# Altium project ASSICopy.PrjPcb
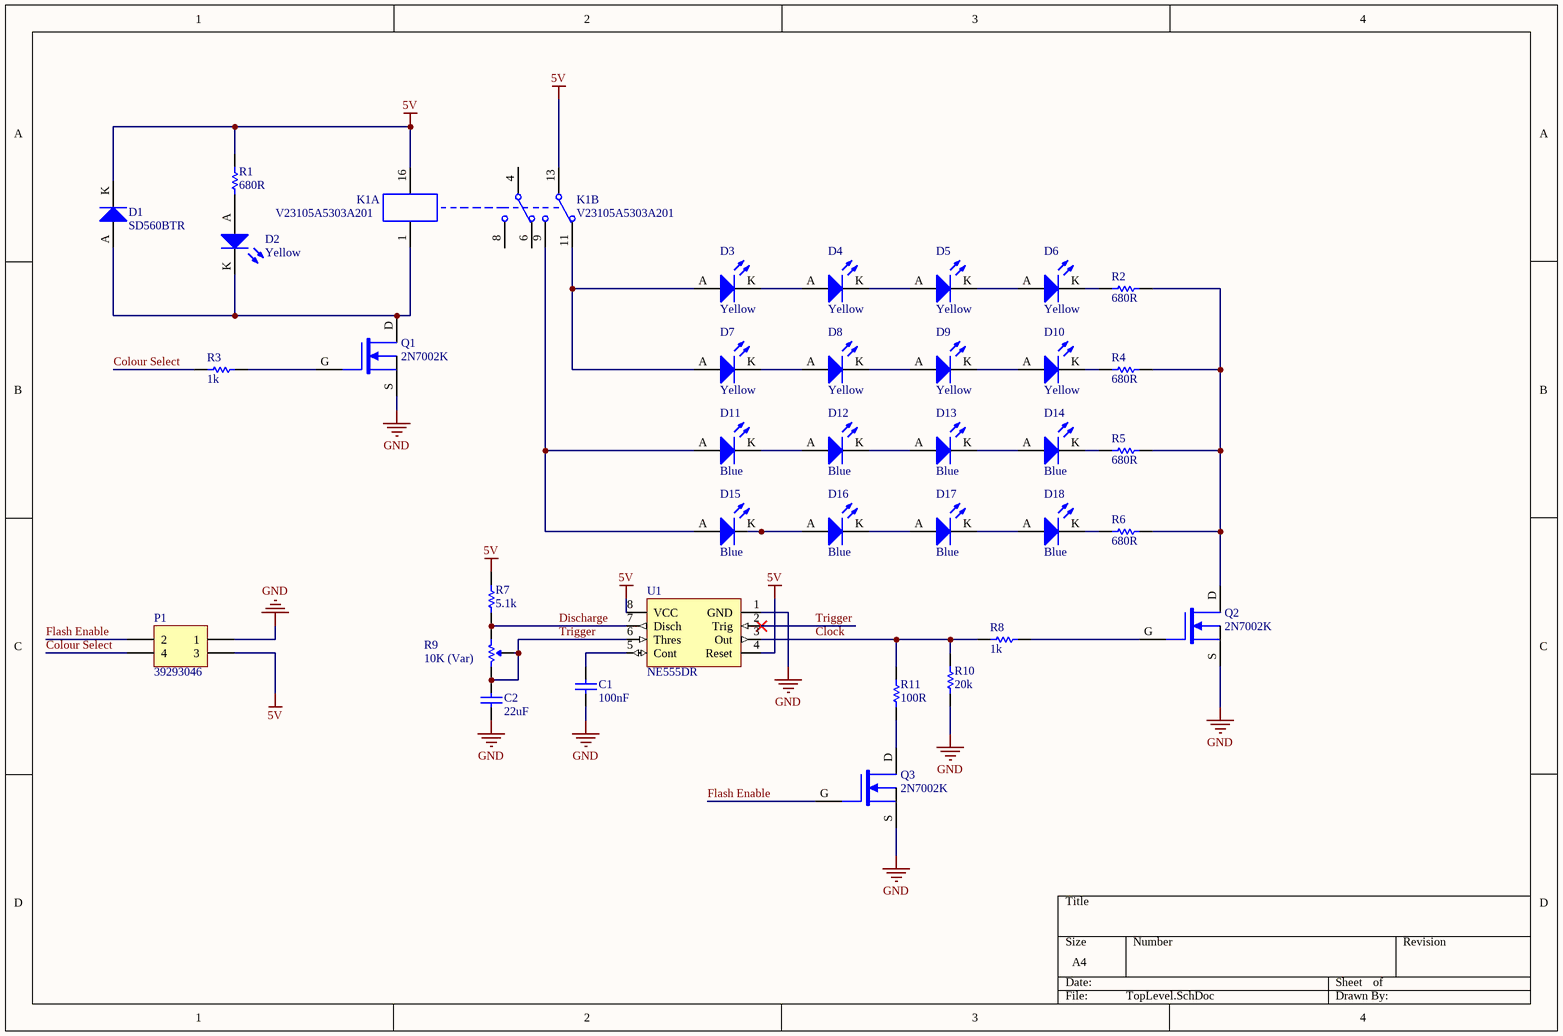
[diagram p0: TopLevel.SchDoc]
1 sheet, 37 parts. Net scope: global (net labels, ports and power ports of the same name join across sheets).
Board file: ASSI_R5.PcbDoc

## Sheet TopLevel.SchDoc
size A4; SheetNumber: 1; SheetTotal: 1

### Parts
C1  100nF  [0805]
C2  22uF  [1206]
D1  SD560BTR  [SMB Diode]
D2  Yellow  [0805 LED]
D3  Yellow  [0805 LED]
D4  Yellow  [0805 LED]
D5  Yellow  [0805 LED]
D6  Yellow  [0805 LED]
D7  Yellow  [0805 LED]
D8  Yellow  [0805 LED]
D9  Yellow  [0805 LED]
D10  Yellow  [0805 LED]
D11  Blue  [0805 LED]
D12  Blue  [0805 LED]
D13  Blue  [0805 LED]
D14  Blue  [0805 LED]
D15  Blue  [0805 LED]
D16  Blue  [0805 LED]
D17  Blue  [0805 LED]
D18  Blue  [0805 LED]
K1  V23105A5303A201  [TI 2-DIL]  (parts A,B of 2)
P1  39293046  [39293046]
Q1  2N7002K  [ON SOT-23 MOSFET]
Q2  2N7002K  [ON SOT-23 MOSFET]
Q3  2N7002K  [ON SOT-23 MOSFET]
R1  680R  [0805]
R2  680R  [0805]
R3  1k  [0805]
R4  680R  [0805]
R5  680R  [0805]
R6  680R  [0805]
R7  5.1k  [0805]
R8  1k  [0805]
R9  10K (Var)  [B 3296]
R10  20k  [0805]
R11  100R  [0805]
U1  NE555DR  [TI 8-SOIC]

### Nets
5V: D1.K K1.13 K1.16 P1.3 R1.2 R7.2 U1.4(Reset) U1.8(VCC)
GND: C1.1 C2.1 P1.1 Q1.S Q2.S Q3.S R10.1 U1.1(GND)
Clock: R8.1 R10.2 R11.2 U1.3(Out)
Colour Select: P1.4 R3.1
Discharge: R7.1 R9.3(CW) U1.7(Disch)
Flash Enable: P1.2 Q3.G
Trigger: C2.2 R9.1(CCW) R9.2(Wiper) U1.2(Trig) U1.6(Thres)
NetC1_2: C1.2 U1.5(Cont)
NetD1_A: D1.A D2.K K1.1 Q1.D
NetD2_A: D2.A R1.1
NetD3_A: D3.A D7.A K1.11
NetD3_K: D3.K D4.A
NetD4_K: D4.K D5.A
NetD5_K: D5.K D6.A
NetD6_K: D6.K R2.1
NetD7_K: D7.K D8.A
NetD8_K: D8.K D9.A
NetD9_K: D9.K D10.A
NetD10_K: D10.K R4.1
NetD11_A: D11.A D15.A K1.9
NetD11_K: D11.K D12.A
NetD12_K: D12.K D13.A
NetD13_K: D13.K D14.A
NetD14_K: D14.K R5.1
NetD15_K: D15.K D16.A
NetD16_K: D16.K D17.A
NetD17_K: D17.K D18.A
NetD18_K: D18.K R6.1
NetQ1_G: Q1.G R3.2
NetQ2_D: Q2.D R2.2 R4.2 R5.2 R6.2
NetQ2_G: Q2.G R8.2
NetQ3_D: Q3.D R11.1

Not connected (* = marked no-connect by the designer): K1 4 6 8

### Library data of the parts
C1 = GCM21BR71H104KA37L: Manufacturer: muRata; Tolerance: ±10%; Material: X7R; Rated Voltage: 50V; Part Number: GCM21BR71H104KA37L; Value: 100nF; Digikey Part Number: 490-6064-1-ND
C2 = CC1206MKX5R7BB226: Manufacturer: YAGEO; Tolerance: 20%; Material: Ceramic; Rated Voltage: 16V; Part Number: CC1206MKX5R7BB226; Value: 22uF; Digikey Part Number: 311-1997-2-ND
D1 = SD560BTR: 1.2V_F 600V 5A SMB; Manufacturer: SMC Diode Solutions; Part Number: SD560BTR; Digikey Part Number: 1655-1530-2-ND; Digikey Link: https://www.digikey.com/product-detail/en/smc-diode-solutions/SD560BTR/1655-1530-2-ND/6022620
D2-D10 = SML-211YTT86: Yellow LED Indication - Discrete 1.75V 0805 (2012 Metric); Manufacturer: ROHM Semiconductor; Part Number: SML-211YTT86; Colour: Yellow; Digikey Part Number: 511-1293-1-ND; Digikey Link: https://www.digikey.com/product-detail/en/rohm-semiconductor/SML-211YTT86/511-1293-1-ND/637106
D11-D18 = SML-MN2BCTT86C: LED BLUE CLEAR 2012 SMD; Manufacturer: ROHM Semiconductor; Part Number: SML-MN2BCTT86C; Colour: Blue; Digikey Part Number: 846-1207-1-ND; Digikey Link: https://www.digikey.com/product-detail/en/rohm-semiconductor/SMLMN2BCTT86C/846-1207-1-ND/6057239
K1 = V23105A5303A201: RELAY TELECOM DPDT 3A 12V; Manufacturer: TE Connectivity; Part Number: V23105A5303A201; Digikey Part Number: PB387-ND; Digikey Link: https://www.digikey.com/product-detail/en/te-connectivity-potter-brumfield-relays/V23105A5303A201/PB387-ND/291023
P1 = 39293046: Pitch: 4.2mm; Row Spacing: 5.5mm; Angle: 0; Flange: No; Contact: Tin; Part Number: 39293046; Positions: 4; Digikey Part Number: WM3844-ND
Q1-Q3 = 2N7002K: 60V 380mA, NFET MOSTFET (Small Signal); Manufacturer: ON Semiconductor; Published: 24-Mar-1999; LatestRevisionDate: 29-May-2009; LatestRevisionNote: IPC-7351 Footprint Added.; PackageVersion: Sep-2000; PackageReference: SOT-343; Publisher: Altium Limited; PackageDescription: 4-Pin SOT-343 Package 1.3 mm Pitch, 2.1 mm Lead Span; Part Number: 2N7002K; Digikey Part Number: 2N7002KCT-ND; Digikey Link: https://www.digikey.com/product-detail/en/on-semiconductor/2N7002K/2N7002KCT-ND/2060375; Qty: 30
R1 R2 R4-R6 = RC0805FR07680RL: Manufacturer: YAGEO; Tolerance: 0.01; Rated Voltage: 0.125W; Part Number: RC0805FR07680RL; Value: 680R; Material: FR-07; Digikey Part Number: 311-680CRCT-ND
R3 R8 = RC0805FR071KL: Manufacturer: YAGEO; Tolerance: 0.01; Rated Voltage: 0.125W; Part Number: RC0805FR071KL; Value: 1k; Material: FR-07; Digikey Part Number: 311-1.00KCRCT-ND
R7 = RC0805FR075K1L: Manufacturer: YAGEO; Tolerance: 0.01; Rated Voltage: 0.125W; Part Number: RC0805FR075K1L; Value: 5.1k; Material: FR-07; Digikey Part Number: 311-5.10KCRCT-ND
R9 = 3296W-1-103LF: Manufacturer: Bournes Inc; Tolerance: 0.1; Rated Voltage: 0.5W; Part Number: 3296W-1-103LF; Value: 10K (Var); Digikey Part Number: 3296W-103LF-ND
R10 = RC0805FR0720KL: Manufacturer: YAGEO; Tolerance: 0.01; Rated Voltage: 0.125W; Part Number: RC0805FR0720KL; Value: 20k; Material: FR-07; Digikey Part Number: 311-20.0KCRCT-ND
R11 = RC0805FR071KL: Manufacturer: YAGEO; Value: 1k; Tolerance: 0.01; Rated Voltage: 0.125W; Part Number: RC0805FR071KL; Material: FR-07; Digikey Part Number: 311-1.00KCRCT-ND
U1 = NE555DR: IC OSC SGL TIMER 100KHZ 8-SOIC; Manufacturer: Texas Instruments; Part Number: NE555DR; Digikey Part Number: 296-6501-1-ND; Digikey Link: https://www.digikey.com.au/product-detail/en/texas-instruments/NE555DR/296-6501-1-ND/372490